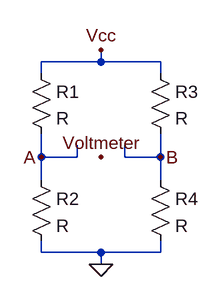
[diagram p0: schematic BridgetoNowhere.asc]
BridgetoNowhere.asc, the LTspice schematic file:
Version 4
SHEET 1 880 680
WIRE 240 48 240 32
WIRE 240 48 160 48
WIRE 320 48 240 48
WIRE 160 64 160 48
WIRE 320 64 320 48
WIRE 160 176 160 144
WIRE 208 176 208 160
WIRE 208 176 160 176
WIRE 272 176 272 160
WIRE 320 176 320 144
WIRE 320 176 272 176
WIRE 160 208 160 176
WIRE 320 208 320 176
WIRE 160 304 160 288
WIRE 240 304 160 304
WIRE 320 304 320 288
WIRE 320 304 240 304
WIRE 240 320 240 304
FLAG 240 32 Vcc
FLAG 240 320 0
FLAG 240 176 Voltmeter
FLAG 160 176 A
FLAG 320 176 B
SYMBOL res 144 48 R0
SYMATTR InstName R1
SYMBOL res 144 192 R0
SYMATTR InstName R2
SYMBOL res 304 48 R0
SYMATTR InstName R3
SYMBOL res 304 192 R0
SYMATTR InstName R4

The netlist it stands for:
* BridgetoNowhere.asc
R1 Vcc A R
R2 A 0 R
R3 Vcc B R
R4 B 0 R
.backanno
.end